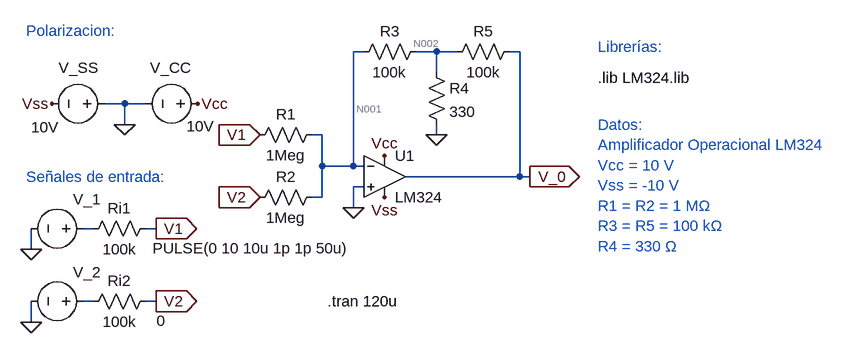
[diagram p0: schematic Lab_2_Circ_1_Ri=100k+SlewRate.asc]
Lab_2_Circ_1_Ri=100k+SlewRate.asc, the LTspice schematic file:
Version 4
SHEET 1 1560 680
WIRE 400 -336 384 -336
WIRE 512 -336 480 -336
WIRE 544 -336 512 -336
WIRE 640 -336 624 -336
WIRE 512 -304 512 -336
WIRE 32 -256 0 -256
WIRE 64 -256 32 -256
WIRE 32 -224 32 -256
WIRE 336 -208 320 -208
WIRE 512 -208 512 -224
WIRE 336 -160 336 -208
WIRE 384 -160 384 -336
WIRE 384 -160 336 -160
WIRE 400 -160 384 -160
WIRE 640 -144 640 -336
WIRE 640 -144 464 -144
WIRE 656 -144 640 -144
WIRE 400 -128 384 -128
WIRE 336 -112 336 -160
WIRE 336 -112 320 -112
WIRE 384 -96 384 -128
WIRE -16 -64 -32 -64
WIRE 80 -64 64 -64
WIRE -112 -32 -112 -64
WIRE -16 48 -32 48
WIRE 80 48 64 48
WIRE -112 80 -112 48
FLAG 144 -256 Vcc
FLAG -80 -256 Vss
FLAG 32 -224 0
FLAG -112 -32 0
FLAG 80 -64 V1
IOPIN 80 -64 Out
FLAG -112 80 0
FLAG 80 48 V2
IOPIN 80 48 Out
FLAG 240 -208 V1
IOPIN 240 -208 In
FLAG 240 -112 V2
IOPIN 240 -112 In
FLAG 384 -96 0
FLAG 432 -176 Vcc
FLAG 432 -112 Vss
FLAG 656 -144 V_0
IOPIN 656 -144 Out
FLAG 512 -208 0
SYMBOL voltage -16 -64 M270
WINDOW 0 45 31 VLeft 2
WINDOW 3 -30 -91 VLeft 2
WINDOW 123 -1 -51 VLeft 2
WINDOW 39 0 0 Left 0
SYMATTR InstName V_1
SYMATTR Value PULSE(0 10 10u 1p 1p 50u)
SYMBOL voltage 160 -256 R90
WINDOW 0 -55 25 VRight 2
WINDOW 3 35 -10 VRight 2
WINDOW 123 0 0 Left 0
WINDOW 39 0 0 Left 0
SYMATTR InstName V_CC
SYMATTR Value 10V
SYMBOL voltage 16 -256 R90
WINDOW 0 -55 25 VRight 2
WINDOW 3 36 85 VRight 2
WINDOW 123 0 0 Left 0
WINDOW 39 0 0 Left 0
SYMATTR InstName V_SS
SYMATTR Value 10V
SYMBOL voltage -16 48 M270
WINDOW 0 45 31 VLeft 2
WINDOW 3 -30 -97 VLeft 2
WINDOW 123 0 0 Left 0
WINDOW 39 0 0 Left 0
SYMATTR InstName V_2
SYMATTR Value 0
SYMBOL res -32 -48 R270
WINDOW 0 32 56 VTop 2
WINDOW 3 0 56 VBottom 2
SYMATTR InstName Ri1
SYMATTR Value 100k
SYMBOL res -32 64 R270
WINDOW 0 32 56 VTop 2
WINDOW 3 0 56 VBottom 2
SYMATTR InstName Ri2
SYMATTR Value 100k
SYMBOL res 336 -224 R90
WINDOW 0 0 56 VBottom 2
WINDOW 3 32 56 VTop 2
SYMATTR InstName R1
SYMATTR Value 1Meg
SYMBOL res 336 -128 R90
WINDOW 0 0 56 VBottom 2
WINDOW 3 32 56 VTop 2
SYMATTR InstName R2
SYMATTR Value 1Meg
SYMBOL OpAmps\\opamp2 432 -208 R0
SYMATTR InstName U1
SYMATTR Value LM324
SYMBOL res 496 -320 R0
SYMATTR InstName R4
SYMATTR Value 330
SYMBOL res 384 -320 R270
WINDOW 0 32 56 VTop 2
WINDOW 3 0 56 VBottom 2
SYMATTR InstName R3
SYMATTR Value 100k
SYMBOL res 528 -320 R270
WINDOW 0 32 56 VTop 2
WINDOW 3 0 56 VBottom 2
SYMATTR InstName R5
SYMATTR Value 100k
TEXT -120 -368 Left 2 ;Polarizacion:
TEXT -120 -144 Left 2 ;Señales de entrada:
TEXT 344 48 Left 2 !.tran 120u
TEXT 760 -296 Left 2 !.lib LM324.lib
TEXT 760 -344 Left 2 ;Librerías:
TEXT 760 -224 Left 2 ;Datos:\nAmplificador Operacional LM324\nVcc = 10 V\nVss = -10 V\nR1 = R2 = 1 MΩ\nR3 = R5 = 100 kΩ\nR4 = 330 Ω

The netlist it stands for:
* Lab_2_Circ_1_Ri=100k+SlewRate.asc
V_1 N003 0 PULSE(0 10 10u 1p 1p 50u)
V_CC Vcc 0 10V
V_SS 0 Vss 10V
V_2 N004 0 0
Ri1 N003 V1 100k
Ri2 N004 V2 100k
R1 N001 V1 1Meg
R2 N001 V2 1Meg
XU1 0 N001 Vcc Vss V_0 LM324  ; pins In+ In- V+ V- OUT
R4 N002 0 330
R3 N001 N002 100k
R5 N002 V_0 100k
* Polarizacion:
* Señales de entrada:
.tran 120u
.lib LM324.lib
* Librerías:
* Datos:
* Amplificador Operacional LM324
* Vcc = 10 V
* Vss = -10 V
* R1 = R2 = 1 MΩ
* R3 = R5 = 100 kΩ
* R4 = 330 Ω
.backanno
.end

* Results of the author's LTspice run, read from the files saved beside the schematic
* Operating Point, zero values left out:
*   V(vcc) = 10 V
*   V(vss) = -10 V
*   V(v1) = -2.495 µV
*   V(v2) = -2.495 µV
*   V(n001) = -27.44 µV
*   V(v_0) = -618 mV
*   V(n002) = -2.026 mV
*   I(R5) = 6.16 µA
*   I(R3) = 19.99 nA
*   I(R4) = -6.14 µA
*   I(R2) = -24.95 pA
*   I(R1) = -24.95 pA
*   I(Ri2) = 24.95 pA
*   I(Ri1) = 24.95 pA
*   I(V_2) = -24.95 pA
*   I(V_ss) = -669.8 µA
*   I(V_cc) = -669.9 µA
*   I(V_1) = -24.95 pA
*   Ix(u1:1) = -19.92 nA
*   Ix(u1:2) = -19.94 nA
*   Ix(u1:3) = 669.9 µA
*   Ix(u1:4) = -669.8 µA
*   Ix(u1:5) = 6.16 µA
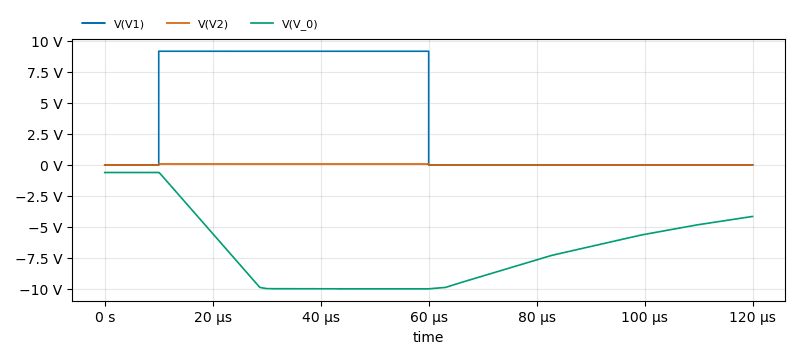
[diagram p1: Transient Analysis of Lab_2_Circ_1_Ri=100k+SlewRate.asc, plotted from the saved traces]
* Transient Analysis, 1 run:
*   V(V1): min -2.326 mV, max 9.161 V, average 3.815 V, rms 5.912 V, last -879.5 µV
*   V(V2): min -2.326 mV, max 69.97 mV, average 27.59 mV, rms 43.94 mV, last -879.5 µV
*   V(V_0): min -9.996 V, max -618 mV, average -6.869 V, rms 7.641 V, last -4.16 V